# Altium project Flight_controller_Project.PrjPcb
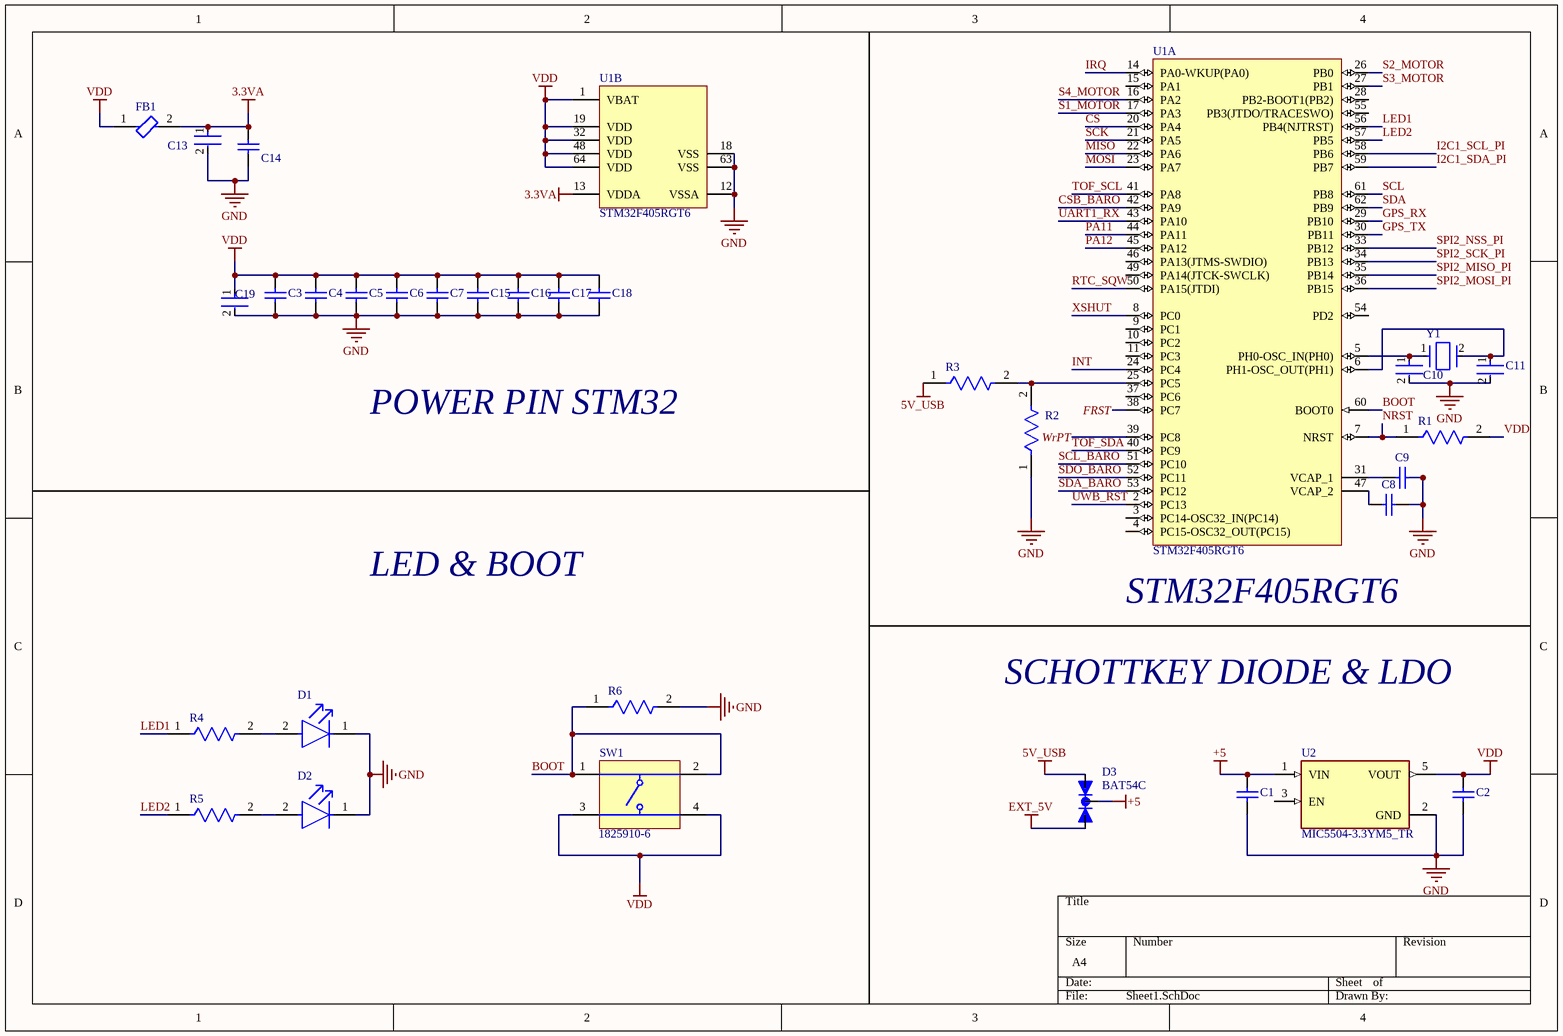
[diagram p0: Sheet1.SchDoc]
3 sheets, 48 parts. Net scope: global (net labels, ports and power ports of the same name join across sheets).
Board file: PCB1.PcbDoc
Sheets:
  Sheet1.SchDoc
  Sheet2.SchDoc
  Sheet3.SchDoc

## Sheet Sheet1.SchDoc
size A4; SheetNumber: 1; SheetTotal: 3

### Parts
C1  0603YG105ZAT4A  [CAPC1608X90X35ML15T15]  (value not drawn)
C2  0603YG105ZAT4A  [CAPC1608X90X35ML15T15]  (value not drawn)
C3  VJ0603Y104KXXAP  [CAPC1608X92X38NL15T08]  (value not drawn)
C4  VJ0603Y104KXXAP  [CAPC1608X92X38NL15T08]  (value not drawn)
C5  VJ0603Y104KXXAP  [CAPC1608X92X38NL15T08]  (value not drawn)
C6  VJ0603Y104KXXAP  [CAPC1608X92X38NL15T08]  (value not drawn)
C7  VJ0603Y104KXXAP  [CAPC1608X92X38NL15T08]  (value not drawn)
C8  VJ0603Y104KXXAP  [CAPC1608X92X38NL15T08]  (value not drawn)
C9  VJ0603Y104KXXAP  [CAPC1608X92X38NL15T08]  (value not drawn)
C10  06035A220JAT2A  [FP-0603-L_1_6_0_15-W_0_81-IPC_C]  (value not drawn)
C11  06035A220JAT2A  [FP-0603-L_1_6_0_15-W_0_81-IPC_C]  (value not drawn)
C13  CGA3E2X7R1H104K080AA  [FP-CGA3E-0_3-0_1-IPC_A]  (value not drawn)
C14  GRM188R71H103KA01D  [CAPC1608X90X35ML10T15]  (value not drawn)
C15  VJ0603Y104KXXAP  [CAPC1608X92X38NL15T08]  (value not drawn)
C16  VJ0603Y104KXXAP  [CAPC1608X92X38NL15T08]  (value not drawn)
C17  VJ0603Y104KXXAP  [CAPC1608X92X38NL15T08]  (value not drawn)
C18  VJ0603Y104KXXAP  [CAPC1608X92X38NL15T08]  (value not drawn)
C19  GRM188R60J106ME47D  [FP-GRM188-0_1-e0_2_0_55-IPC_A]  (value not drawn)
D1  LG L29K-G2J1-24-Z  [FP-LG_L29K-MFG]  (value not drawn)
D2  VLMS1300-GS08  [FP-6_541-5092_01-4-MFG]  (value not drawn)
D3  BAT54C  [SOT23-R]
FB1  MPZ2012S101ATD25  [FP-MPZ2012-MFG]  (value not drawn)
R1  AC0603FR-0710KL  [FP-AC0603-MFG]  (value not drawn)
R2  MCT06030C1002FP500  [FP-MCT0603-IPC_C]  (value not drawn)
R3  MCT06030C1002FP500  [FP-MCT0603-IPC_C]  (value not drawn)
R4  AC0603FR-071KL  [FP-AC0603-IPC_B]  (value not drawn)
R5  AC0603FR-071KL  [FP-AC0603-IPC_B]  (value not drawn)
R6  AC0603FR-0710KL  [FP-AC0603-MFG]  (value not drawn)
SW1  1825910-6  [TECO-1825910-6_V]
U1  STM32F405RGT6  [STM-LQFP64_M]  (parts A,B of 2)
U2  MIC5504-3.3YM5_TR  [SOT95P280X145-5N]
Y1  ABM7-8.000MHZ-8-R80-D2Y-T  [FP-ABM7-MFG]  (value not drawn)

### Nets
3.3VA: C13.1 C14.2 FB1.2 U1.13(VDDA)
5V_USB: D3.1(A1) R3.1
+5: C1.2 D3.3(C) U2.1(VIN)
EXT_5V: D3.2(A2)
GND: C1.1 C2.1 C3.1 C4.1 C5.1 C6.1 C7.1 C8.1 C9.1 C10.2 C11.2 C13.2 C14.1 C15.1 C16.1 C17.1 C18.1 C19.2 D1.1(C) D2.1(C) R2.1 R6.2 U1.12(VSSA) U1.18(VSS) U1.63(VSS) U2.2(GND)
VDD: C2.2 C3.2 C4.2 C5.2 C6.2 C7.2 C15.2 C16.2 C17.2 C18.2 C19.1 FB1.1 R1.2 SW1.3 SW1.4 U1.1(VBAT) U1.19(VDD) U1.32(VDD) U1.48(VDD) U1.64(VDD) U2.5(VOUT)
BOOT: R6.1 SW1.1 SW1.2 U1.60(BOOT0)
CS: U1.20(PA4)
CSB_BARO: U1.42(PA9)
FRST: U1.38(PC7)
GPS_RX: U1.29(PB10)
GPS_TX: U1.30(PB11)
I2C1_SCL_PI: U1.58(PB6)
I2C1_SDA_PI: U1.59(PB7)
INT: U1.24(PC4)
IRQ: U1.14(PA0-WKUP(PA0))
LED1: R4.1 U1.56(PB4(NJTRST))
LED2: R5.1 U1.57(PB5)
MISO: U1.22(PA6)
MOSI: U1.23(PA7)
NRST: R1.1 U1.7(NRST)
PA11: U1.44(PA11)
PA12: U1.45(PA12)
RTC_SQW: U1.50(PA15(JTDI))
S1_MOTOR: U1.17(PA3)
S2_MOTOR: U1.26(PB0)
S3_MOTOR: U1.27(PB1)
S4_MOTOR: U1.16(PA2)
SCK: U1.21(PA5)
SCL: U1.61(PB8)
SCL_BARO: U1.51(PC10)
SDA: U1.62(PB9)
SDA_BARO: U1.53(PC12)
SDO_BARO: U1.52(PC11)
SPI2_MISO_PI: U1.35(PB14)
SPI2_MOSI_PI: U1.36(PB15)
SPI2_NSS_PI: U1.33(PB12)
SPI2_SCK_PI: U1.34(PB13)
TOF_SCL: U1.41(PA8)
TOF_SDA: U1.40(PC9)
UART1_RX: U1.43(PA10)
UWB_RST: U1.2(PC13)
WrPT: U1.39(PC8)
XSHUT: U1.8(PC0)
NetC8_2: C8.2 U1.47(VCAP_2)
NetC9_2: C9.2 U1.31(VCAP_1)
NetC10_1: C10.1 U1.5(PH0-OSC_IN(PH0)) Y1.1
NetC11_1: C11.1 U1.6(PH1-OSC_OUT(PH1)) Y1.2
NetD1_2: D1.2(A) R4.2
NetD2_2: D2.2(A) R5.2
NetR2_2: R2.2 R3.2 U1.25(PC5)

Not connected (* = marked no-connect by the designer): U1 3(PC14-OSC32_IN(PC14)) 4(PC15-OSC32_OUT(PC15)) 9(PC1) 10(PC2) 11(PC3) 15(PA1) 28(PB2-BOOT1(PB2)) 37(PC6) 46(PA13(JTMS-SWDIO)) 49(PA14(JTCK-SWCLK)) 54(PD2) 55(PB3(JTDO/TRACESWO)); U2 3(EN)

### Notes on the sheet
- POWER PIN STM32
- LED & BOOT
- (near U1) STM32F405RGT6
- SCHOTTKEY DIODE & LDO

### Library data of the parts
C1 C2 = CMP-2006-04543-1: Manufacturer: AVX Interconnect / Elco; Part Number: 0603YG105ZAT4A
C3-C7 C15-C18 = CMP-2006-01166-1: Manufacturer: Vitramon; Part Number: VJ0603Y104KXXAP
C8 C9 = CMP-2006-01166-1: 100nf; Manufacturer: Vitramon; Part Number: VJ0603Y104KXXAP
C10 C11 = CMP-2006-04207-3: General Purpose Ceramic Capacitor, 0603, 22pF, 5%, NP0, 30ppm/°C, 50V; Dielectric: C0G; Insulation Resistance: 100GR; Termination: SMD/SMT; Lead Free: Lead Free; Package Quantity: 1; Thickness: 0.035inch; Packaging: Tape and Reel; Radiation Hardening: No; Voltage Rating: 50V; Depth: 0.81mm; Case Code (Metric): 1608; Min Operating Temperature: -55°C; Number of Pins: 2; REACH SVHC: No SVHC; RoHS Compliant: Yes; Mount: Surface Mount; Case/Package: 0603; Width: 0.81mm; Case Code (Imperial): 0603; Max Operating Temperature: 125°C; Contact Plating: Tin; Temperature Coefficient: 30ppm/°C; Voltage Rating (DC): 50V; Height: 0.63mm; Dielectric Material: Ceramic; Capacitance: 22pF; Voltage: 50V; Length: 1.6mm; Tolerance: 5%
C13 = CMP-2000-07546-2: Cap Ceramic 100nF 50V X7R 10% Pad SMD 0603 +125°C Automotive T/R; Weight: 7.1E-05oz; Composition: Ceramic; Max Operating Temperature: 125°C; Termination: SMD/SMT; Dielectric: X7R; Length: 1.6mm; Package Quantity: 1; REACH SVHC: No SVHC; Lead Free: Lead Free; Case Code (Metric): 1608; Min Operating Temperature: -55°C; Packaging: Tape and Reel; Tolerance: 10%; Voltage Rating: 50V; Case Code (Imperial): 0603; Capacitance: 100nF; Case/Package: 0603; Voltage Rating (DC): 50V; Depth: 0.8mm; Radiation Hardening: No; Ratings: AEC-Q200; Mount: Surface Mount; Voltage: 50V; Thickness: 0.035inch; Width: 0.8mm; Height: 0.8mm
C14 = CMP-2100-03642-1: Chip Capacitor, 10 nF, +/- 10%, 50 V, -55 to 125 degC, 0603 (1608 Metric), RoHS, Tape and Reel; Manufacturer: Murata; Insulation Resistance: 10GR; Dielectric: X7R; Voltage Rating: 50V; Capacitance: 10nF; Material: Ceramic; Package Quantity: 1; Lead Free: LeadFree; Case/Package: 0603; Termination: SMD/SMT; REACH SVHC: Unknown; Manufacturer URL: http://www.murata.com/; Datasheet URL: http://search.murata.co.jp/Ceramy/image/img/A01X/G101/ENG/GRM188R71H103KA01-01.pdf; Mount: SurfaceMount; Datasheet Version: 42401.0; Number of Pins: 2; Length: 1.6mm; Voltage: 50V; Depth: 0.8mm; Tolerance: 10%; Min Operating Temperature: -55degC; Voltage Rating (DC): 50V; Max Operating Temperature: 125degC; Package Description: 2-Pin Surface Mount Device, Body 1.6 x 0.8 mm; RoHSCompliant: True; Case Code (Imperial): 0603; Width: 0.031inch; Case Code (Metric): 1608; Height: 0.8mm; Package Reference: 0603; Packaging: TapeandReel; Thickness: 0.035inch; Dielectric Material: Ceramic
C19 = CMP-2006-02792-2: Chip Multilayer Ceramic Capacitors for General Purpose, 0603, 10uF, X5R, 15%, 20%, 6.3V; Packaging: Tape and Reel; Voltage Rating (DC): 6.3V; Width: 0.031inch; Termination: SMD/SMT; Dielectric: X5R; Package Quantity: 4000; Voltage Rating: 6.3V; Capacitance: 10uF; Case/Package: 0603; Min Operating Temperature: -55°C; Voltage: 6.3V; Length: 1.6mm; Thickness: 0.035inch; Lead Free: Lead Free; Depth: 0.8mm; Case Code (Imperial): 0603; Max Operating Temperature: 85°C; Material: Ceramic; Height: 0.8mm; Tolerance: 20%; Mount: Surface Mount; REACH SVHC: No SVHC; Radiation Hardening: No; Case Code (Metric): 1608
D1 = CMP-62016-000024-1: LED GREEN DIFFUSED 0603 SMD; Number of LEDs: 1; Forward Current: 20mA; Luminous Intensity: 5.6mcd; Luminous Flux: 0.012lm; Dominant Wavelength: 570nm; Lens Style: Flat; Forward Voltage: 2.2V; Reverse Voltage: 12V; Viewing Angle: 160°; Lens Size: 0.8mm; Test Current: 2mA; Lens Color: White; Length: 1.3mm; Radiation Hardening: No; Color: Green; Number of Pins: 2; Depth: 0.8mm; Number of Elements: 1; Case Code (Metric): 1608; Case Code (Imperial): 0603; Illumination Color: Green; Width: 0.8mm; Lens Transparency: Diffused; Mount: Surface Mount; Min Operating Temperature: -40°C; Packaging: Tape and Reel; Max Operating Temperature: 100°C; Case/Package: 0603; Height: 0.65mm; Package Quantity: 5000
D2 = CMP-02520-000012-1: LED RED 0603 SMD; Manufacturer: Vishay; Forward Voltage: 2V; Reverse Voltage: 5V; Power Dissipation: 75mW; Forward Current: 20mA; Luminous Intensity: 54mcd; Led Orientation: Top View; Peak Emmision Wavelength: 639nm; Viewing Angle: 130°; Wavelength: 631nm; Digikey Description: LED RED 0603 SMD; Height: 1mm; Colour: Red; Ambient Temperature Range High: +85°C; Ambient Temperature Range Low: -35°C; Package: 6.541-5092.01-4; Automotive: No; Temperature Range High: +85°C; Device Class L3: unset; Lead Free: Yes; Temperature Range Low: -35°C; Temperature: -35°C to +85°C; Manufacturer Part Number: VLMS1300-GS08; Device Class L2: LEDs; ComponentLink2Description: Datasheet; Octopart: https://octopart.com/vlms1300-gs08-vishay-21709201; Device Class L1: Optoelectronics; RoHS: TRUE; ComponentLink2URL: http://www.vishay.com/docs/82437/vlmo1300.pdf; Mouser Description: Standard LEDs - SMD Super Red Clear Non-Diff; Category: Diode
D3 = BAT54C: DIODE, SCHOTTKY, DUAL; Diode Type:Schottky; Voltage, Vrrm:30V; Current, If AV:300mA; Current, Ifsm:1A; Voltage, Vf Max:0.4V; Max Junction Temperature, Tj:150Â°C; Termination Type:SMD; Case Style:SOT-23; No. of Pins:3; Current, If ;RoHS Compliant: Yes; MF: ON Semiconductor; SnapEDA_Link: https://www.snapeda.com/parts/BAT54C/Onsemi/view-part/?ref=snap; Package: SOT-23-3 ON Semiconductor; Value: *; MP: BAT54C; Check_prices: https://www.snapeda.com/parts/BAT54C/Onsemi/view-part/?ref=eda
FB1 = CMP-08257-000007-1: FERRITE BEAD 100 OHM 0805 1LN; Max Current Rating: 4A; Impedance: 100R; Tolerance: 25%; Test Frequency: 100MHz; DC Resistance (DCR): 20mR; Number of Lines: 1; Ratings: AEC-Q200; Height: 0.85mm; Length: 0.079inch; Max DC Current: 4A; Lead Free: Lead Free; Termination: SMD/SMT; Min Operating Temperature: -55°C; Mount: Surface Mount; Core Material: Ferrite; Packaging: Tape and Reel; Case Code (Imperial): 0805; Package Quantity: 4000; Depth: 1.25mm; Case/Package: 0805; Width: 1.25mm; Case Code (Metric): 2012; Max Operating Temperature: 125°C; Weight: 0.000194oz
R1 R6 = CMP-2000-04818-3: RES 10KΩ 1.00% 0.1W 0603; Power Rating: 100mW; Tolerance: 1%; Resistance: 10kR; Voltage Rating: 50V; Temperature Coefficient: 100ppm/°C; Ratings: AEC-Q200; Case Code (Metric): 1608; Max Power Dissipation: 100mW; Height: 0.45mm; Package Quantity: 1; Max Operating Temperature: 155°C; Resistor Type: Thick Film; Depth: 0.8mm; RoHS Compliant: Yes; Min Operating Temperature: -55°C; Packaging: Tape and Reel; Number of Terminations: 2; Length: 1.6mm; Features: Moisture Resistant; Military Standard: Not; Case Code (Imperial): 0603; Size Code: 0603; Termination: SMD/SMT; Case/Package: 0603; Mount: Surface Mount; Width: 0.8mm; Lead Free: Lead Free; Series: AC; Construction: Rectangular
R2 R3 = CMP-02407-000418-1: RES SMD 100 OHM 1% 1/8W 0603; Voltage Rating: 75V; Power Rating: 100mW; Temperature Coefficient: 50ppm/°C; Max Power Dissipation: 125mW; Resistance: 10kR; Case/Package: 0603; Military Standard: Not; Min Operating Temperature: -55°C; Width: 0.8mm; Package Quantity: 1; Max Operating Temperature: 125°C; Tolerance: 1%; Depth: 0.85mm; Radiation Hardening: No; Mount: Surface Mount; Composition: Thin Film; Contact Plating: Tin; Lead Free: Lead Free; Case Code (Imperial): 0603; Number of Terminations: 2; Voltage Rating (DC): 75V; Length: 1.55mm; Packaging: Tape and Reel; Height: 0.022inch; Case Code (Metric): 1608
R4 R5 = CMP-2000-04828-3: RES 1kΩ 1.00% 0.1W 0603; Voltage Rating: 50V; Power Rating: 100mW; Tolerance: 1%; Temperature Coefficient: 100ppm/°C; Resistance: 1kR; Depth: 0.8mm; Case/Package: 0603; Size Code: 0603; Case Code (Metric): 1608; Height: 0.022inch; Series: AC; Width: 0.031inch; Construction: Rectangular; Length: 0.063inch; Case Code (Imperial): 0603; Package Quantity: 1; RoHS Compliant: Yes; Features: Moisture Resistant; Resistor Type: Thick Film; Max Power Dissipation: 100mW; Packaging: Tape and Reel; Termination: SMD/SMT; Ratings: AEC-Q200; Max Operating Temperature: 155°C; Min Operating Temperature: -55°C; Military Standard: Not; Lead Free: Lead Free; Number of Terminations: 2
SW1 = CMP-1684-00021-1: Tact Switch, SPST-NO, 0.05 A, -35 to 85 degC, 4-Pin THD, RoHS, Bulk; Manufacturer: TE Connectivity; Maximum Contact Resistance: 100mOhm; Mechanical Life: 100000Cycles; Bushing Type: Unthreaded; Switch Configuration: OFF(ON); Maximum DC Voltage Rating: 24V; Contact Rating @ Voltage: 0.05A@24VDC; Actuator Color: Black; Body Orientation: Straight; Function: MomentaryContact; Illumination: N/R; Actuator Style: RoundButton; Actuator Material: PolybutyleneTerephthalate; Dielectric Strength: 500VAC; Pole Throw Configuration: SPST; Actuator Length: 1.4mm; Product Weight: N/A; Contact Material: CopperAlloy; Housing Material: N/A; Terminal Type: PCPins; Minimum Insulation Resistance: 100MOhm; Package Description: 4-Pin Through Hole Device, Body 5.99 x 5.99 mm, Pitch 6.5 mm; Part No: 1825910-6; Package Reference: THD; Base Material: N/A; Manufacturer URL: http://www.te.com; Contact Plating: Silver; RoHS: Yes; Datasheet Version: Rev. C9; Electrical Life: 100000Cycles; Maximum AC Voltage Rating: N/A; Thread Size: N/R; Operating Temperature: -35to85C; Mounting: ThroughHole; Dimension: 5.99x5mm; Datasheet URL: http://www.te.com/commerce/DocumentDelivery/DDEController?Action=showdoc&DocId=Customer+Drawing%7F1825910%7FC9%7Fpdf%7FEnglish%7FENG_CD_1825910_C9.pdf%7F1825910-6; Family: 1825910; Seal Location: N/A; Seal Description: N/A; Packaging: N/A
U1 = CMP-0243-00019-3: ARM Cortex-M4 32-bit MCU+FPU, 210 DMIPS, 1024 kB Flash, 192 kB Internal RAM, 51 I/Os, 64-pin LQFP, -40 to 85 degC, Tray; Manufacturer: STMicroelectronics; Supply Voltage(Vcc) min (V): 1.8; Supply Voltage(Vcc) max (V): 3.6; Internal RAM Size (kB): 192; I/Os (High Current): 51; D/A Converter: 2x12-bit; FLASH Size (Prog) (kB): 1024; Operating Frequency(F) (Processor speed) (MHz): 168; ComponentLink2Description: Datasheet; PackageVersion: Rev. 4, 06/2013; DatasheetVersion: Rev. 4; Core: ARM Cortex-M4; ComponentLink2URL: http://www.st.com/st-web-ui/static/active/en/resource/technical/document/datasheet/DM00037051.pdf; PackageReference: LQFP64; Packing: Tray; ComponentLink1Description: Manufacturer URL; ComponentLink3URL: http://www.st.com/st-web-ui/static/active/en/resource/technical/document/datasheet/DM00037051.pdf; ComponentLink3Description: Package Specification; Mounting Technology: Surface Mount; ComponentLink1URL: http://www.st.com/web/en/home.html; PackageDescription: 64-Pin Low Profile Quad Flat Package, 10 x 10 mm Body, 0.5 mm Pitch; PartNumber: STM32F405RGT6
U2 = MIC5504-3.3YM5_TR: Linear Voltage Regulator IC Positive Fixed 1 Output 300mA SOT-23-5; MF: Microchip; MP: MIC5504-3.3YM5 TR; SnapEDA_Link: https://www.snapeda.com/parts/MIC5504-3.3YM5%20TR/Microchip/view-part/?ref=snap; Package: SOT-23 Microchip; Value: *; Check_prices: https://www.snapeda.com/parts/MIC5504-3.3YM5%20TR/Microchip/view-part/?ref=eda
Y1 = CMP-27762-013691-1: Crystal 8MHz ±20ppm 8pF SMD-2 6mm x 3.5mm; ESR (Equivalent Series Resistance): 80R; Frequency Stability: 30ppm; Case/Package: SMD/SMT; Load Capacitance: 8pF; Packaging: Tape and Reel; Frequency Tolerance: 20ppm; Frequency: 8MHz; Mount: Surface Mount; Max Operating Temperature: 85°C; Min Operating Temperature: -40°C

## Sheet Sheet2.SchDoc
size A4; SheetNumber: 2; SheetTotal: 3
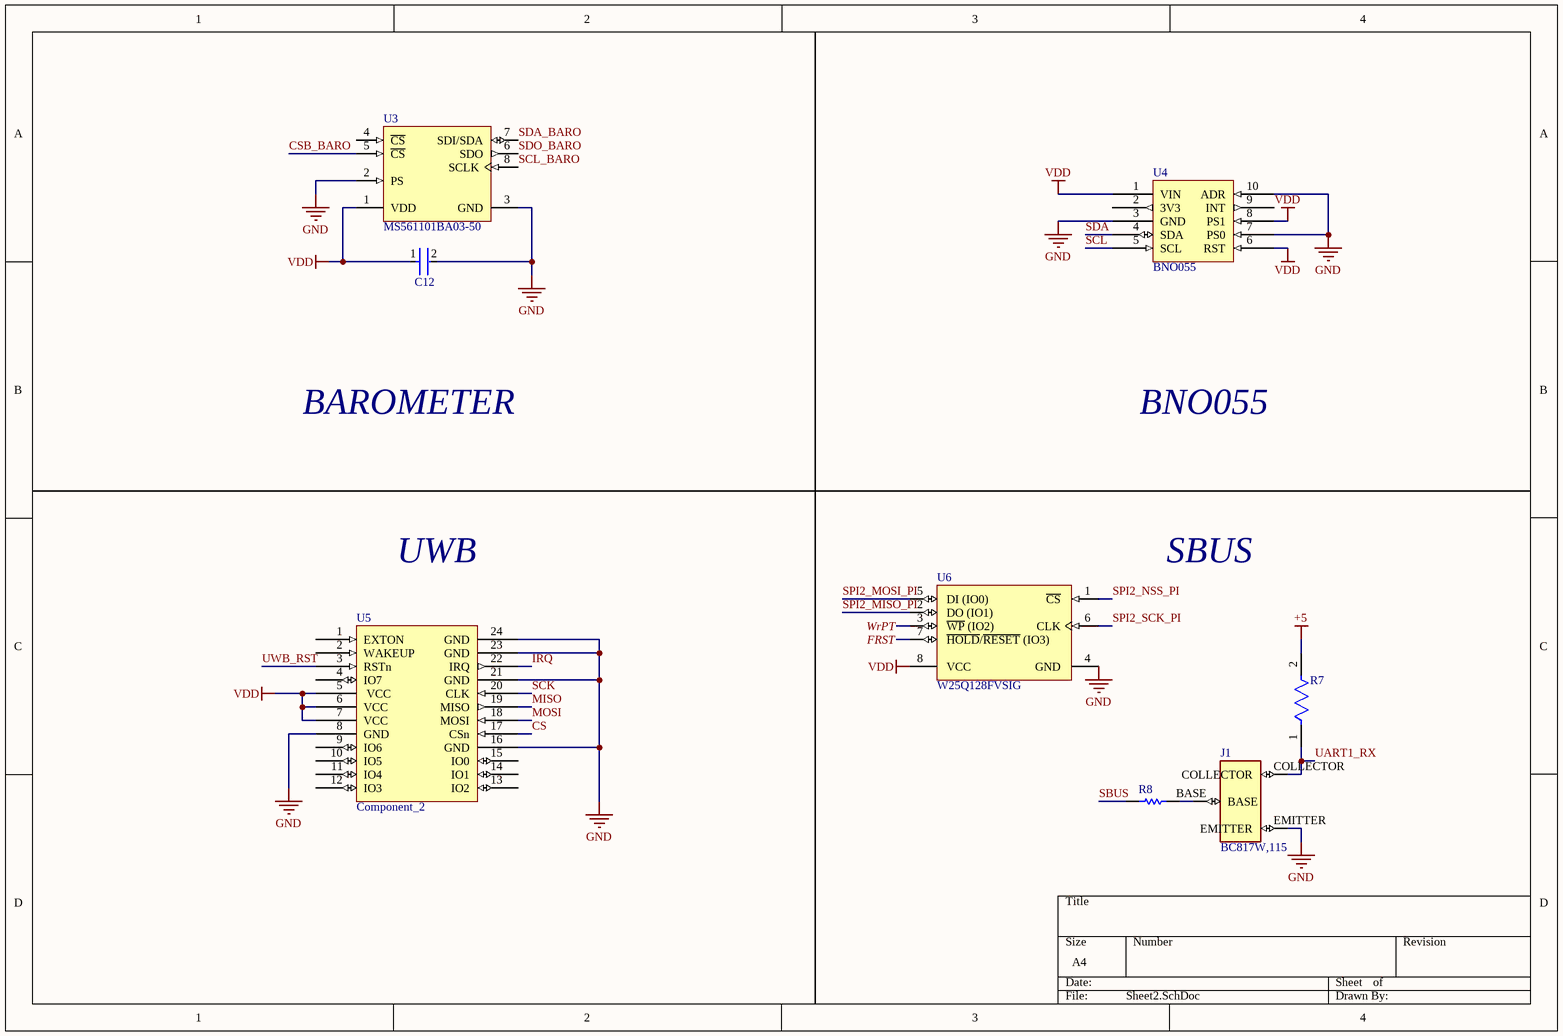
[diagram p1: Sheet2.SchDoc]

### Parts
C12  C0603C104K4RACTU  [FP-C0603C-CF-MFG]  (value not drawn)
J1  BC817W,115  [SOT323]
R7  MCT06030C1002FP500  [FP-MCT0603-IPC_C]  (value not drawn)
R8  RC0603JR-074K7L  [RESC1608X55X25ML10T15]  (value not drawn)
U3  MS561101BA03-50  [MSI-MS561101BA03-50-8_V]
U4  BNO055  [BNO055_MOD]
U5  Component_2  [BU01]
U6  W25Q128FVSIG  [WINB-SOIC-8_M]

### Nets
+5: R7.2
GND: C12.2 J1.EMITTER U3.2(PS) U3.3(GND) U4.3(GND) U4.7(PS0) U4.10(ADR) U5.8(GND) U5.16(GND) U5.21(GND) U5.23(GND) U5.24(GND) U6.4(GND)
VDD: C12.1 U3.1(VDD) U4.1(VIN) U4.6(RST) U4.8(PS1) U5.5(VCC) U5.6(VCC) U5.7(VCC) U6.8(VCC)
CS: U5.17(CSn)
CSB_BARO: U3.5(~{CS})
FRST: U6.7(~{HOLD}/~{RESET}_(IO3))
IRQ: U5.22(IRQ)
MISO: U5.19(MISO)
MOSI: U5.18(MOSI)
SBUS: R8.1
SCK: U5.20(CLK)
SCL: U4.5(SCL)
SCL_BARO: U3.8(SCLK)
SDA: U4.4(SDA)
SDA_BARO: U3.7(SDI/SDA)
SDO_BARO: U3.6(SDO)
SPI2_MISO_PI: U6.2(DO_(IO1))
SPI2_MOSI_PI: U6.5(DI_(IO0))
SPI2_NSS_PI: U6.1(~{CS})
SPI2_SCK_PI: U6.6(CLK)
UART1_RX: J1.COLLECTOR R7.1
UWB_RST: U5.3(RSTn)
WrPT: U6.3(~{WP}_(IO2))
NetJ1_BASE: J1.BASE R8.2

Not connected (* = marked no-connect by the designer): U3 4(~{CS}); U4 2(3V3) 9(INT); U5 1(EXTON) 2(WAKEUP) 4(IO7) 9(IO6) 10(IO5) 11(IO4) 12(IO3) 13(IO2) 14(IO1) 15(IO0)

### Notes on the sheet
- BAROMETER
- BNO055
- UWB
- SBUS

### Library data of the parts
C12 = CMP-2006-03811-3: Capacitor; Ceramic; Cap; .100uF; Tol 10%; SMT; Vol-Rtg 16V; X7R; Tape and Reel; Manufacturer: KEMET; Value: 0.10 μF; Temperature Coefficient: 30ppm/°C; Automotive Grade: Grade 1; Tolerance: 0.1; Digikey Description: Capacitor; Ceramic; Cap; .100uF; Tol 10%; SMT; Vol-Rtg 16V; X7R; Tape and Reel; Automotive: Yes; Temperature Range High: +125°C; Device Class L1: Passive Components; Material: Ceramic; Lead Free: Yes; Device Class L2: Capacitors; Capacitance: 0.10 μF; Height: 0.87mm; Voltage Rating: 16 V; Manufacturer Part Number: C0603C104K4RACTU; Octopart: https://octopart.com/c0603c104k4ractu-kemet-93067; Package: C0603C-CF; Temperature Characteristic: X7R; Device Class L3: Ceramic Capacitors; ComponentLink2URL: https://api.kemet.com/component-edge/download/datasheet/C0603C100J5GACAUTO.pdf; Temperature Range Low: -55°C; ComponentLink2Description: Datasheet; Mouser Description: Multilayer Ceramic Capacitors MLCC - SMD/SMT 16volts 0.1uF 10% X7R 10%; RoHS: TRUE; Temperature: -55°C to +125°C; Category: Cap
J1 = BC817W,115: Bipolar (BJT) Transistor NPN 45 V 500 mA 100MHz 200 mW Surface Mount SOT-323; MF: Nexperia USA; Purchase-URL: https://pricing.snapeda.com/search/part/BC817W,115/?ref=eda; Package: SC-70-3 Nexperia USA Inc.; SnapEDA_Link: https://www.snapeda.com/parts/BC817W,115/Nexperia/view-part/?ref=snap; Availability: In Stock; Value: *; MP: BC817W,115; Check_prices: https://www.snapeda.com/parts/BC817W,115/Nexperia/view-part/?ref=eda; Price: None
R7 = CMP-02407-000418-1: as R2 on sheet Sheet1; Case/Package: 0603; Military Standard: Not; Min Operating Temperature: -55°C; Width: 0.8mm; Package Quantity: 1; Max Operating Temperature: 125°C; Tolerance: 1%; Depth: 0.85mm; Radiation Hardening: No; Mount: Surface Mount; Composition: Thin Film; Contact Plating: Tin; Lead Free: Lead Free; Case Code (Imperial): 0603; Number of Terminations: 2; Voltage Rating (DC): 75V; Length: 1.55mm; Packaging: Tape and Reel; Height: 0.022inch; Case Code (Metric): 1608
R8 = CMP-2000-05024-1: Chip Resistor, 4.7 KOhm, +/- 5%, 100 mW, -55 to 155 degC, 0603 (1608 Metric), RoHS, Tape and Reel; Manufacturer: Yageo; Resistance: 4.7kOhms; Temperature Coefficient: 100PPM/C; Power Rating: 100mW; Voltage Rating: 50V; Operating Temperature Range: -55Cto+155C; Case Code - mm: 1608; Tolerance: 5%; Product: ThickFilmResistorsGeneralPurpose; Case Code - in: 0603; Datasheet URL: http://www.yageo.com/documents/recent/PYu-RC_Group_51_RoHS_L_04.pdf; Package Reference: 603; Datasheet Version: Rev. 4, 02/2016; Package Description: 2-Pin Surface Mount Device, Body 1.6 x 0.8 mm; Manufacturer URL: http://www.yageo.com/; Series: RC; Packaging: Reel; Termination Style: SMD/SMT
U3 = CMP-2000-05251-1: Barometric Pressure Sensor, with Stainless Steel Cap, 1.8 to 3.6 V, -45 to 85 degC, 8-Pin QFN, RoHS, Tape and Reel; Manufacturer: Measurement Specialties; Operating Pressure Max: 1200mbar; Supply Current: 12.5µA; Supply Voltage Max: 3.6V; Supply Voltage Min: 1.8V; No. of Pins: 8; Connection Size: 0.5mm; SVHC: NoSVHC(20-Jun-2013); Operating Pressure Min: 10mbar; Manufacturer URL: http://www.meas-spec.com/; Operating Temperature Min: -40degC; Pressure Type: Barometric; Package Reference: MS561101BA03-50-8; Datasheet URL: http://www.te.com/commerce/DocumentDelivery/DDEController?Action=srchrtrv&DocNm=MS5611-01BA03&DocType=Data+Sheet&DocLang=English&DocFormat=pdf&PartCntxt=CAT-BLPS0036; Package Description: 8-Pin Surface Mount Device, Body 5 x 3 mm, Pitch 1.25 mm; Sensor Case Style: QFN; Datasheet Version: Sep-15; Operating Temperature Max: 85degC
U4 = Component_1
U6 = CMP-2000-05005-1: 3V 128M-Bit Serial Flash Memory with Dual/Quad SPI & QPI, 2.7 to 3.6 V, -40 to 85 degC, 8-Pin SOIC, RoHS, Tape and Reel; Manufacturer: Winbond; Number of Words: 16777216; Address Bus: 24b; Word Size: 8b; Boot Type: NotRequired; Supply Current: 20mA; Operating Supply Voltage (Max): 3.6V; Sync/Async: Synchronous; Rad Hardened: No; Interface Type: Serial(SPI); Access Time (Max): 7ns; Operating Supply Voltage (Min): 2.7V; Operating Supply Voltage (Typ): 3/3.3V; Programmable: Yes; Density: 134217728Bit; Cell Type: NOR; Package Description: 8-Pin Small Outline Integrated Circuit, Body 5.28 x 5.28 mm, Pitch 1.27 mm; Datasheet URL: http://download.siliconexpert.com/pdfs/2015/11/30/6/42/17/890/win_/manual/3w25q128fv20rev.l2008242015.pdf; Package Reference: SS-8; Package Type: SOICW; Datasheet Version: Rev. L, 08/2015; Manufacturer URL: http://www.winbond.com/hq/index.html?__locale=en; Pin Count: 8; Operating Temperature Classification: Industrial; Operating Temperature (Min): -40C; Program/Erase Volt (Typ): 2.7to3.6V; Operating Temperature (Max): 85C; Mounting: SurfaceMount; Operating Temp Range: -40Cto85C

## Sheet Sheet3.SchDoc
size A4; SheetNumber: 3; SheetTotal: 3
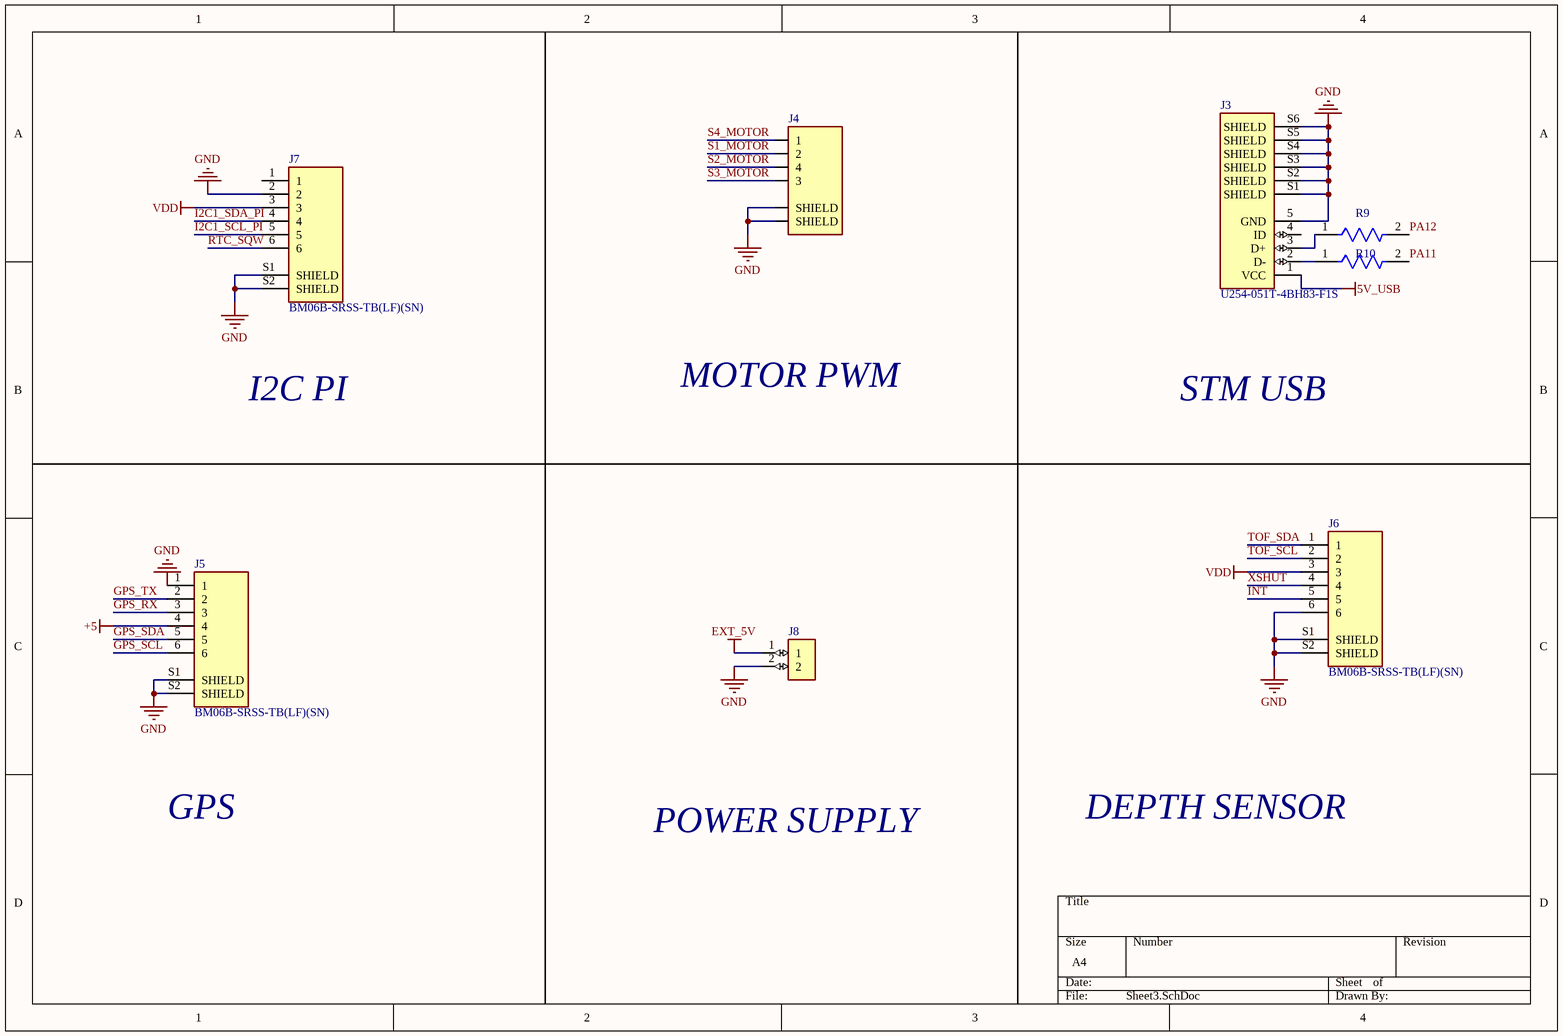
[diagram p2: Sheet3.SchDoc]

### Parts
J3  U254-051T-4BH83-F1S  [XKB_U254-051T-4BH83-F1S]
J4  SM04B-SRSS-TB(LF)(SN)  [JST_SM04B-SRSS-TB(LF)(SN)]  (value not drawn)
J5  BM06B-SRSS-TB(LF)(SN)  [JST_BM06B-SRSS-TB(LF)(SN)]
J6  BM06B-SRSS-TB(LF)(SN)  [JST_BM06B-SRSS-TB(LF)(SN)]
J7  BM06B-SRSS-TB(LF)(SN)  [JST_BM06B-SRSS-TB(LF)(SN)]
J8  SM02B-SRSS-TB(LF)(SN)  [SM02B-SRSS-TB(LF)(SN)]  (value not drawn)
R9  CPF0603B22RE1  [FP-CPF0603-MFG]  (value not drawn)
R10  CPF0603B22RE1  [FP-CPF0603-MFG]  (value not drawn)

### Nets
5V_USB: J3.1(VCC)
+5: J5.4
EXT_5V: J8.1
GND: J3.5(GND) J3.S1(SHIELD) J3.S2(SHIELD) J3.S3(SHIELD) J3.S4(SHIELD) J3.S5(SHIELD) J3.S6(SHIELD) J4.S1(SHIELD) J4.S2(SHIELD) J5.1 J5.S1(SHIELD) J5.S2(SHIELD) J6.6 J6.S1(SHIELD) J6.S2(SHIELD) J7.2 J7.S1(SHIELD) J7.S2(SHIELD) J8.2
VDD: J6.3 J7.3
GPS_RX: J5.3
GPS_SCL: J5.6
GPS_SDA: J5.5
GPS_TX: J5.2
I2C1_SCL_PI: J7.5
I2C1_SDA_PI: J7.4
INT: J6.5
PA11: R10.2
PA12: R9.2
RTC_SQW: J7.6
S1_MOTOR: J4.2
S2_MOTOR: J4.4
S3_MOTOR: J4.3
S4_MOTOR: J4.1
TOF_SCL: J6.2
TOF_SDA: J6.1
XSHUT: J6.4
NetJ3_2: J3.2(D-) R10.1
NetJ3_3: J3.3(D+) R9.1

Not connected (* = marked no-connect by the designer): J3 4(ID); J7 1

### Notes on the sheet
- I2C PI
- MOTOR PWM
- STM USB
- GPS
- POWER SUPPLY
- DEPTH SENSOR

### Library data of the parts
J3 = U254-051T-4BH83-F1S: USB - Micro B Female USB 2 5 SMD USB Connectors RoHS; MF: XKB Industrial Precision; SnapEDA_Link: https://www.snapeda.com/parts/U254-051T-4BH83-F1S/XKB+Industrial+Precision/view-part/?ref=snap; Package: Package; Value: *; MP: U254-051T-4BH83-F1S; Check_prices: https://www.snapeda.com/parts/U254-051T-4BH83-F1S/XKB+Industrial+Precision/view-part/?ref=eda
J4 = SM04B-SRSS-TB(LF)(SN): Connector Header Surface Mount, Right Angle 4 position 0.039 (1.00mm); MF: JST Sales; SnapEDA_Link: https://www.snapeda.com/parts/SM04B-SRSS-TB(LF)(SN)/JST/view-part/?ref=snap; Package: None; Value: *; MP: SM04B-SRSS-TB(LF)(SN); Check_prices: https://www.snapeda.com/parts/SM04B-SRSS-TB(LF)(SN)/JST/view-part/?ref=eda
J8 = SM02B-SRSS-TB(LF)(SN): Connector Header Surface Mount, Right Angle 2 position 0.039 (1.00mm); MF: JST Sales; SnapEDA_Link: https://www.snapeda.com/parts/SM02B-SRSS-TB(LF)(SN)/JST/view-part/?ref=snap; Package: None; Value: *; MP: SM02B-SRSS-TB(LF)(SN); Check_prices: https://www.snapeda.com/parts/SM02B-SRSS-TB(LF)(SN)/JST/view-part/?ref=eda
R9 R10 = CMP-03211-007811-1: RES SMD 22Ω 0.1% 1/16W 0603; Manufacturer: TE Connectivity; Temperature Coefficient: 25ppm/°C; Power Rating: 0.063W; Voltage Rating: 50V; Automotive: No; ComponentLink2Description: Datasheet; Package: CPF0603; Temperature Range High: +155°C; Device Class L1: Passive Components; Resistance: 22Ω; Device Class L3: Chip SMD Resistors; packaging: 1k Reel; Temperature: -55°C to +155°C; Octopart: https://octopart.com/cpf0603b22re1-te+connectivity-9539398; Manufacturer Part Number: CPF0603B22RE1; ComponentLink2URL: https://www.te.com/commerce/DocumentDelivery/DDEController?Action=showdoc&DocId=Data+Sheet%7F1773200%7FM%7Fpdf%7FEnglish%7FENG_DS_1773200_M.pdf%7F3-1676481-2; Value: 22Ω; Device Class L2: Resistors; Height: 0.55mm; RoHS: TRUE; Composition: Thin Film; Lead Free: Yes; octopart_url: https://octopart.com/cpf0603b22re1-te+connectivity-9539398; Tolerance: 0.1%; Ipc Land Pattern Name: RESC15580X45; Category: Res; Temperature Range Low: -55°C; Series: CPF
J5-J7 = BM06B-SRSS-TB(LF)(SN): Package: None; Price: None; Value: *; MP: BM06B-SRSS-TB(LF)(SN); Availability: Unavailable

## Nets that join several sheets
5V_USB: Sheet1 (D3.1 R3.1), Sheet3 (J3.1)
+5: Sheet1 (C1.2 D3.3 U2.1), Sheet2 (R7.2), Sheet3 (J5.4)
EXT_5V: Sheet1 (D3.2), Sheet3 (J8.1)
GND: Sheet1 (26 pins), Sheet2 (13 pins), Sheet3 (19 pins)
VDD: Sheet1 (21 pins), Sheet2 (9 pins), Sheet3 (J6.3 J7.3)
CS: Sheet1 (U1.20), Sheet2 (U5.17)
CSB_BARO: Sheet1 (U1.42), Sheet2 (U3.5)
FRST: Sheet1 (U1.38), Sheet2 (U6.7)
GPS_RX: Sheet1 (U1.29), Sheet3 (J5.3)
GPS_TX: Sheet1 (U1.30), Sheet3 (J5.2)
I2C1_SCL_PI: Sheet1 (U1.58), Sheet3 (J7.5)
I2C1_SDA_PI: Sheet1 (U1.59), Sheet3 (J7.4)
INT: Sheet1 (U1.24), Sheet3 (J6.5)
IRQ: Sheet1 (U1.14), Sheet2 (U5.22)
MISO: Sheet1 (U1.22), Sheet2 (U5.19)
MOSI: Sheet1 (U1.23), Sheet2 (U5.18)
PA11: Sheet1 (U1.44), Sheet3 (R10.2)
PA12: Sheet1 (U1.45), Sheet3 (R9.2)
RTC_SQW: Sheet1 (U1.50), Sheet3 (J7.6)
S1_MOTOR: Sheet1 (U1.17), Sheet3 (J4.2)
S2_MOTOR: Sheet1 (U1.26), Sheet3 (J4.4)
S3_MOTOR: Sheet1 (U1.27), Sheet3 (J4.3)
S4_MOTOR: Sheet1 (U1.16), Sheet3 (J4.1)
SCK: Sheet1 (U1.21), Sheet2 (U5.20)
SCL: Sheet1 (U1.61), Sheet2 (U4.5)
SCL_BARO: Sheet1 (U1.51), Sheet2 (U3.8)
SDA: Sheet1 (U1.62), Sheet2 (U4.4)
SDA_BARO: Sheet1 (U1.53), Sheet2 (U3.7)
SDO_BARO: Sheet1 (U1.52), Sheet2 (U3.6)
SPI2_MISO_PI: Sheet1 (U1.35), Sheet2 (U6.2)
SPI2_MOSI_PI: Sheet1 (U1.36), Sheet2 (U6.5)
SPI2_NSS_PI: Sheet1 (U1.33), Sheet2 (U6.1)
SPI2_SCK_PI: Sheet1 (U1.34), Sheet2 (U6.6)
TOF_SCL: Sheet1 (U1.41), Sheet3 (J6.2)
TOF_SDA: Sheet1 (U1.40), Sheet3 (J6.1)
UART1_RX: Sheet1 (U1.43), Sheet2 (J1.COLLECTOR R7.1)
UWB_RST: Sheet1 (U1.2), Sheet2 (U5.3)
WrPT: Sheet1 (U1.39), Sheet2 (U6.3)
XSHUT: Sheet1 (U1.8), Sheet3 (J6.4)